# EAGLE design 足駆動回路 (EAGLE 9.6.2)
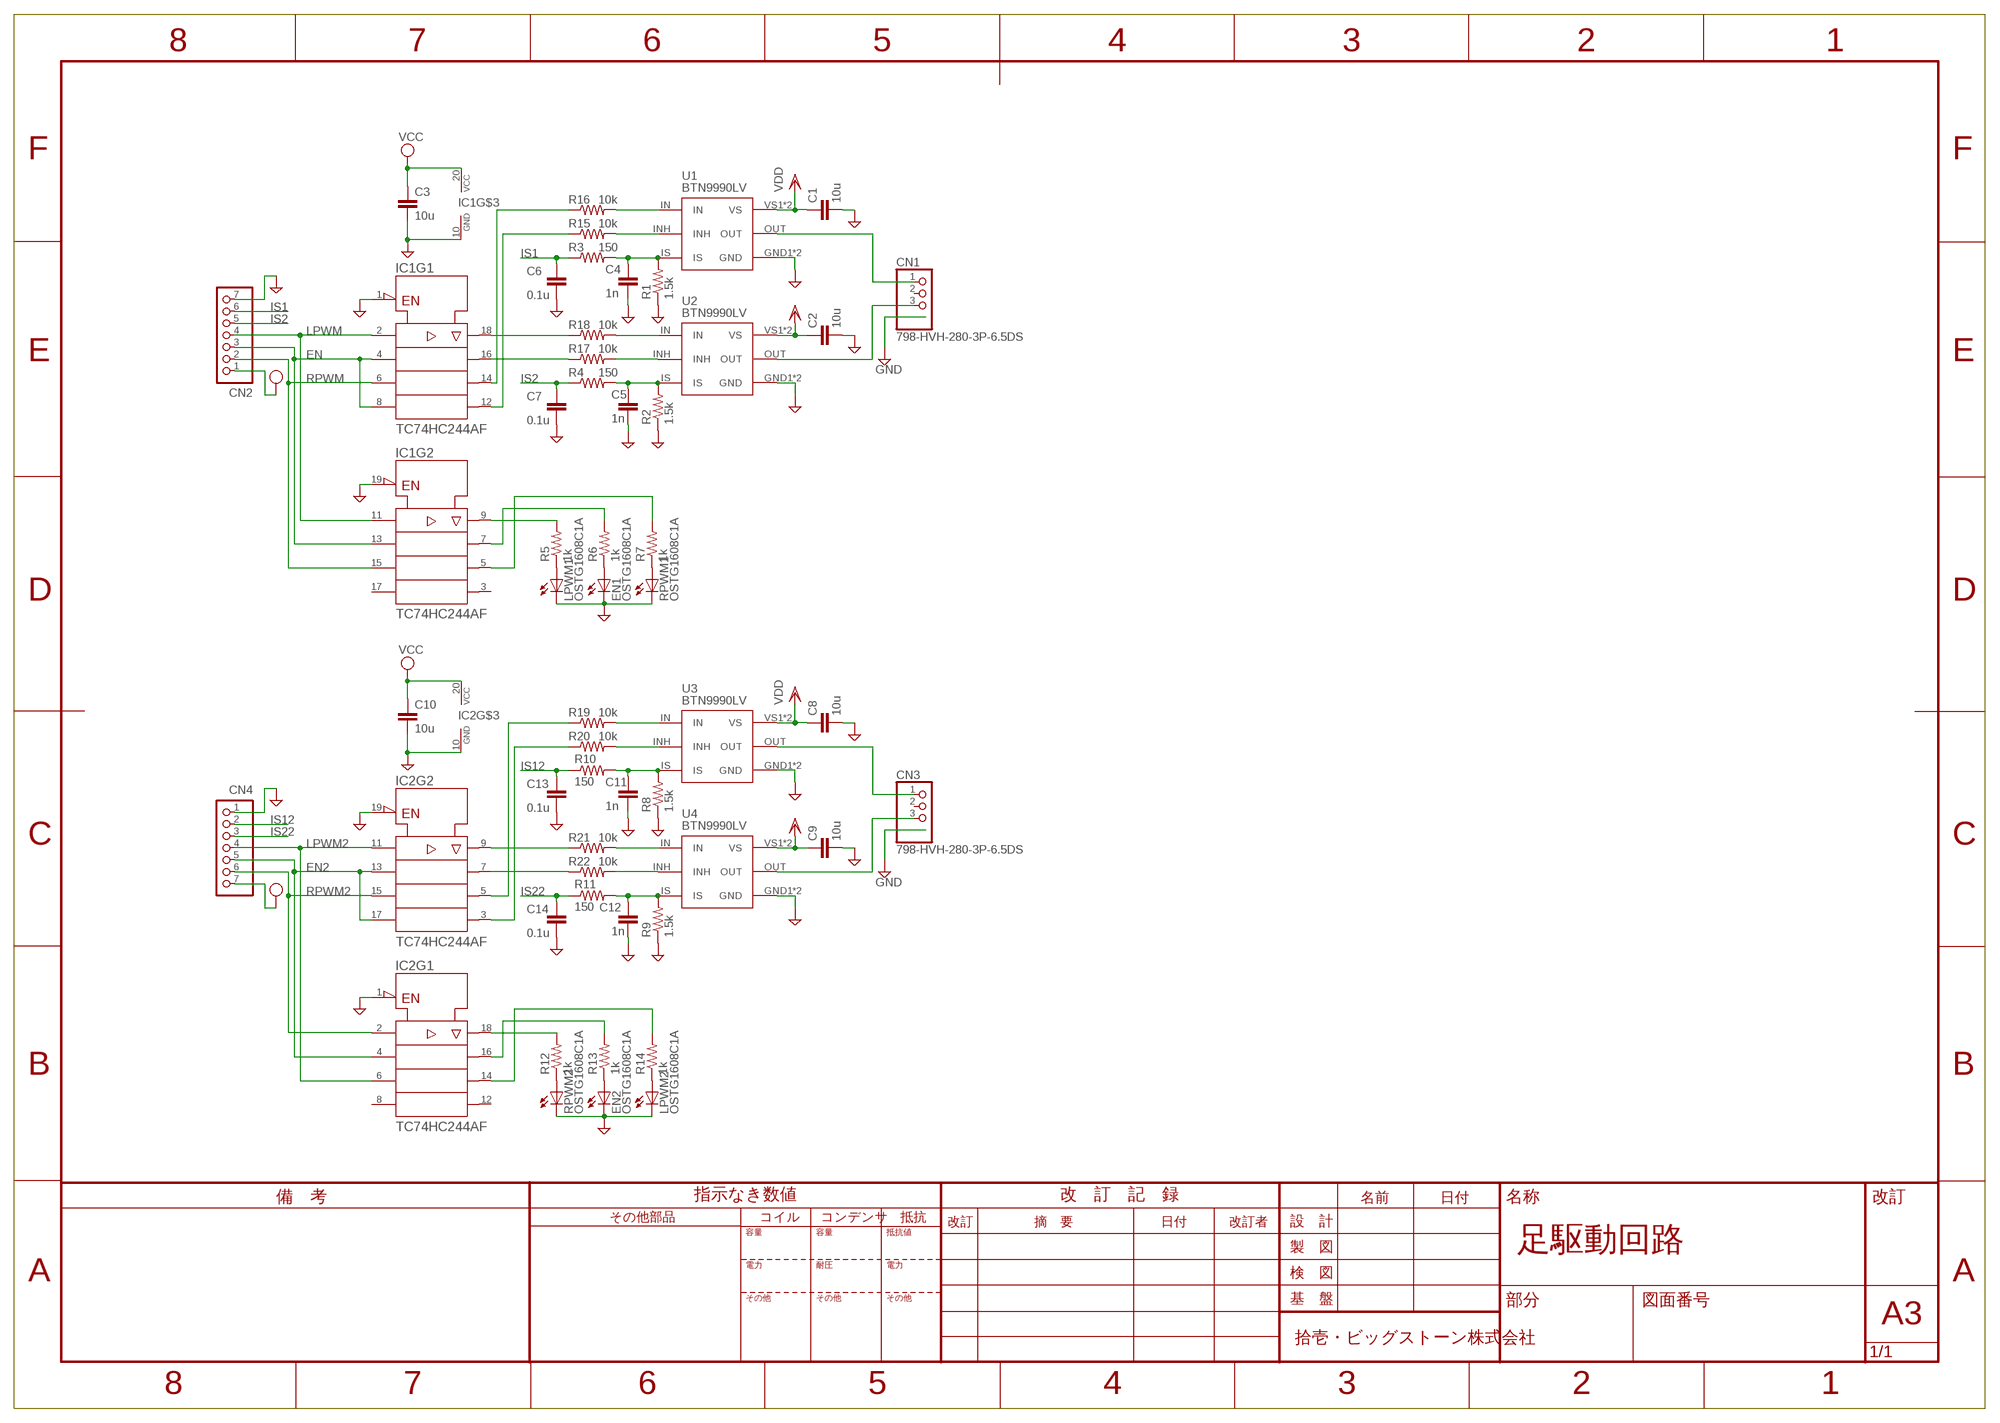
[diagram p0: schematic, sheet 1]

## Parts
C1  10u  GCM31CD71H106KE36K  [C3216]
C2  10u  GCM31CD71H106KE36K  [C3216]
C3  10u  GCM31CD71H106KE36K  [C3216]
C4  1n  GCM188R91H102KA37D  [C1608]
C5  1n  GCM188R91H102KA37D  [C1608]
C6  0.1u  GCM188L81H104KA57D  [C1608]
C7  0.1u  GCM188L81H104KA57D  [C1608]
C8  10u  GCM31CD71H106KE36K  [C3216]
C9  10u  GCM31CD71H106KE36K  [C3216]
C10  10u  GCM31CD71H106KE36K  [C3216]
C11  1n  GCM188R91H102KA37D  [C1608]
C12  1n  GCM188R91H102KA37D  [C1608]
C13  0.1u  GCM188L81H104KA57D  [C1608]
C14  0.1u  GCM188L81H104KA57D  [C1608]
CN1  798-HVH-280-3P-6.5DS  [798-HVH-280-3P-6.5DS]
CN2  B7B-XH-A  [B7B-XH-A]
CN3  798-HVH-280-3P-6.5DS  [798-HVH-280-3P-6.5DS]
CN4  B7B-XH-A  [B7B-XH-A]
EN1  OSTG1608C1A  [LEDC1608X39N_G]
EN2  OSTG1608C1A  [LEDC1608X39N_G]
IC1  TC74HC244AF  [SOP20]
IC2  TC74HC244AF  [SOP20]
LPWM1  OSTG1608C1A  [LEDC1608X39N_G]
LPWM2  OSTG1608C1A  [LEDC1608X39N_G]
R1  1.5k  R1608  [R0603]
R2  1.5k  R1608  [R0603]
R3  150  R1608  [R0603]
R4  150  R1608  [R0603]
R5  1k  R1608  [R0603]
R6  1k  R1608  [R0603]
R7  1k  R1608  [R0603]
R8  1.5k  R1608  [R0603]
R9  1.5k  R1608  [R0603]
R10  150  R1608  [R0603]
R11  150  R1608  [R0603]
R12  1k  R1608  [R0603]
R13  1k  R1608  [R0603]
R14  1k  R1608  [R0603]
R15  10k  RC0603J10K  [R1608]
R16  10k  RC0603J10K  [R1608]
R17  10k  RC0603J10K  [R1608]
R18  10k  RC0603J10K  [R1608]
R19  10k  RC0603J10K  [R1608]
R20  10k  RC0603J10K  [R1608]
R21  10k  RC0603J10K  [R1608]
R22  10k  RC0603J10K  [R1608]
RPWM1  OSTG1608C1A  [LEDC1608X39N_G]
RPWM2  OSTG1608C1A  [LEDC1608X39N_G]
U1  BTN9990LV  [BTN9990LV]
U2  BTN9990LV  [BTN9990LV]
U3  BTN9990LV  [BTN9990LV]
U4  BTN9990LV  [BTN9990LV]

## Nets
EN: CN2.3 IC1.4(A2) IC1.8(A4) IC1.13(A2)
EN2: CN4.5 IC2.4(A2) IC2.13(A2) IC2.17(A4)
GND: C1.2 C2.2 C3.2 C4.2 C5.2 C6.2 C7.2 C8.2 C9.2 C10.2 C11.2 C12.2 C13.2 C14.2 CN1.P$1 CN1.P$2 CN1.P$3 CN1.P$4 CN2.7 CN3.P$1 CN3.P$2 CN3.P$3 CN3.P$4 CN4.1 EN1.K(C) EN2.K(C) IC1.1(!G) IC1.10(GND) IC1.19(!G) IC2.1(!G) IC2.10(GND) IC2.19(!G) LPWM1.K(C) LPWM2.K(C) R1.1 R2.1 R8.1 R9.1 RPWM1.K(C) RPWM2.K(C) U1.GND1(GND) U1.GND2(GND) U2.GND1(GND) U2.GND2(GND) U3.GND1(GND) U3.GND2(GND) U4.GND1(GND) U4.GND2(GND)
IS1: C6.1 CN2.6 R3.1
IS1_A: C4.1 R1.2 R3.2 U1.IS
IS1_A1: C11.1 R8.2 R10.2 U3.IS
IS2: C7.1 CN2.5 R4.1
IS2_1: C5.1 R2.2 R4.2 U2.IS
IS2_2: C12.1 R9.2 R11.2 U4.IS
IS12: C13.1 CN4.2 R10.1
IS22: C14.1 CN4.3 R11.1
LPWM: CN2.4 IC1.2(A1) IC1.11(A1)
LPWM2: CN4.4 IC2.6(A3) IC2.11(A1)
N$1: IC1.18(Y1) R18.1
N$2: IC1.16(Y2) R17.1
N$3: IC1.14(Y3) R16.1
N$4: IC1.12(Y4) R15.1
N$5: LPWM1.A R5.1
N$6: EN1.A R6.1
N$7: R7.1 RPWM1.A
N$8: IC1.9(Y1) R5.2
N$9: IC1.7(Y2) R6.2
N$10: IC1.5(Y3) R7.2
N$11: IC2.9(Y1) R21.1
N$12: IC2.7(Y2) R22.1
N$13: IC2.5(Y3) R19.1
N$14: IC2.3(Y4) R20.1
N$15: R12.1 RPWM2.A
N$16: EN2.A R13.1
N$17: LPWM2.A R14.1
N$18: IC2.18(Y1) R12.2
N$19: IC2.16(Y2) R13.2
N$20: IC2.14(Y3) R14.2
N$21: R15.2 U1.INH
N$22: R16.2 U1.IN
N$23: R17.2 U2.INH
N$24: R18.2 U2.IN
N$25: R19.2 U3.IN
N$26: R20.2 U3.INH
N$27: R21.2 U4.IN
N$28: R22.2 U4.INH
OUT1 [power]: CN1.1 U1.OUT
OUT2 [power]: CN1.3 U2.OUT
OUT3 [power]: CN3.1 U3.OUT
OUT4 [power]: CN3.3 U4.OUT
RPWM: CN2.2 IC1.6(A3) IC1.15(A3)
RPWM2: CN4.6 IC2.2(A1) IC2.15(A3)
VCC: C3.1 C10.1 CN2.1 CN4.7 IC1.20(VCC) IC2.20(VCC)
VDD [power]: C1.1 C2.1 C8.1 C9.1 U1.VS1(VS) U1.VS2(VS) U2.VS1(VS) U2.VS2(VS) U3.VS1(VS) U3.VS2(VS) U4.VS1(VS) U4.VS2(VS)
Unconnected: CN1.2 CN3.2 IC1.3(Y4) IC1.17(A4) IC2.8(A4) IC2.12(Y4)

## Library data of the parts
C1-C3 C8-C10 = 村田製作所_チップセラミックコンデンサ:GCM?*: 一般用チップ積層セラミックコンデンサ GCMシリーズ; 01_CLASS: チップセラミックコンデンサ; 02_BENDER: DigiKey; 03_MAKER: ㈱村田製作所; 04_CHARA: 50V X7T ±10%; 05_COST: 245222; 06_QTY: 6000; 10_DIGIKEY_CODE: 490-GCM31CD71H106KE36KDKR-ND
C4 C5 C11 C12 = 村田製作所_チップセラミックコンデンサ:GCM?*: 一般用チップ積層セラミックコンデンサ GCMシリーズ; 01_CLASS: チップセラミックコンデンサ; 02_BENDER: DigiKey; 03_MAKER: ㈱村田製作所; 04_CHARA: 50V X8R ±10%; 05_COST: 13782; 06_QTY: 4000; 10_DIGIKEY_CODE: 490-14360-2-ND
C6 C7 C13 C14 = 村田製作所_チップセラミックコンデンサ:GCM?*: 一般用チップ積層セラミックコンデンサ GCMシリーズ; 01_CLASS: チップセラミックコンデンサ; 02_BENDER: DigiKey; 03_MAKER: ㈱村田製作所; 04_CHARA: 50V X8L ±10%; 05_COST: 14655; 06_QTY: 4000; 10_DIGIKEY_CODE: 490-6049-6-ND
CN1 CN3 = HVH-280:798-HVH-280-3P-6.5DS
CN2 CN4 = jst-xh:B7B-XH-A: Wire-to-Board 2.5mm pitch top mount connector Source: http://www.jst-mfg.com/product/pdf/jpn/XH.pdf http://www.jst-mfg.com/product/detail.php?series=277
EN1 EN2 LPWM1 LPWM2 RPWM1 RPWM2 = LED:OSTG1608C1A: 緑色チップＬＥＤ ［１６０８］ ＯＳＴＧ１６０８Ｃ１Ａ （２０個入） [OSTG1608C1A] 通販コード I-06417 発売日 2013/03/26 ・標準電流：5mA ◆絶対最大定格(Ta=25℃) ・VR：5V ・PD：100mW ◆電気光学特性(IF=5mA、Ta=25℃、Typ.) ・VF：2.9V ・IV：103mcd D：525nm ・2θ1/2：120° ■カラーバリエーション 白色I-03986 </catalog/g/gI-03986/> 赤色I-03978 </catalog/g/gI-03978/> 緑色I-06417 </catalog/g/gI-06417/> 青色I-03982 </catalog/g/gI-03982/> 黄色I-03984 </catalog/g/gI-03984/> 橙色I-06416 </catalog/g/gI-06416/> 黄緑色I-03980 </catalog/g/gI-03980/> ウォームホワイト色I-09640 </catalog/g/gI-09640> [I-06417] 緑色チップＬＥＤ ［１６０８］ ＯＳＴＧ１６０８Ｃ１Ａ （２０個入） 1パック ￥250（税込）
IC1 IC2 = 東芝_74LSシリーズ:TC74HC244
R1-R14 = RCL:R: RESISTOR, American symbol; SPICEPREFIX: R
R15-R22 = FLE_抵抗器:RC0603J: チップ抵抗 RCシリーズ 1608サイズ; 01_CLASS: チップ抵抗; 02_BENDER: 秋月電子通商; 03_MAKER: FAITHFUL LINK INDUSTRIAL CORP.; 04_CHARA: 1/10W ±5%; 05_COST: 980; 06_QTY: 5000; 10_AKIZUKI_CODE: R-15029
U1-U4 = IT_MotorControlIC:BTN9990LV

## Net classes
1 power: clearance 0.254 mm

## Board
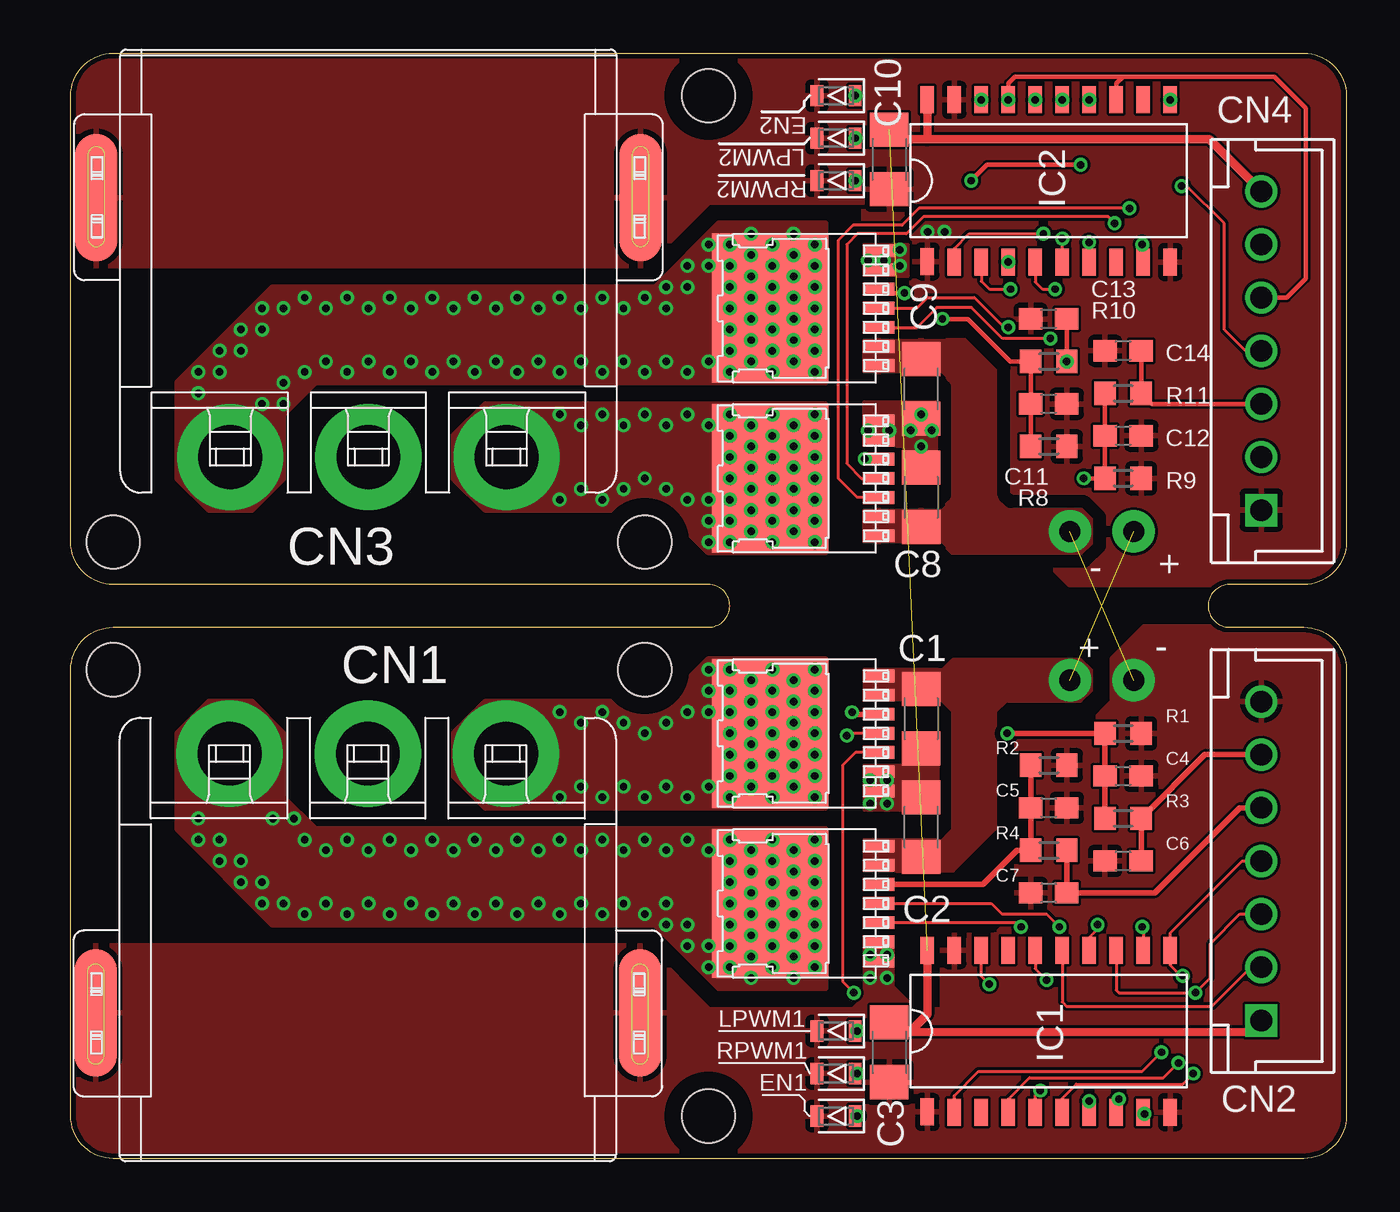
[diagram p1: board, top side]
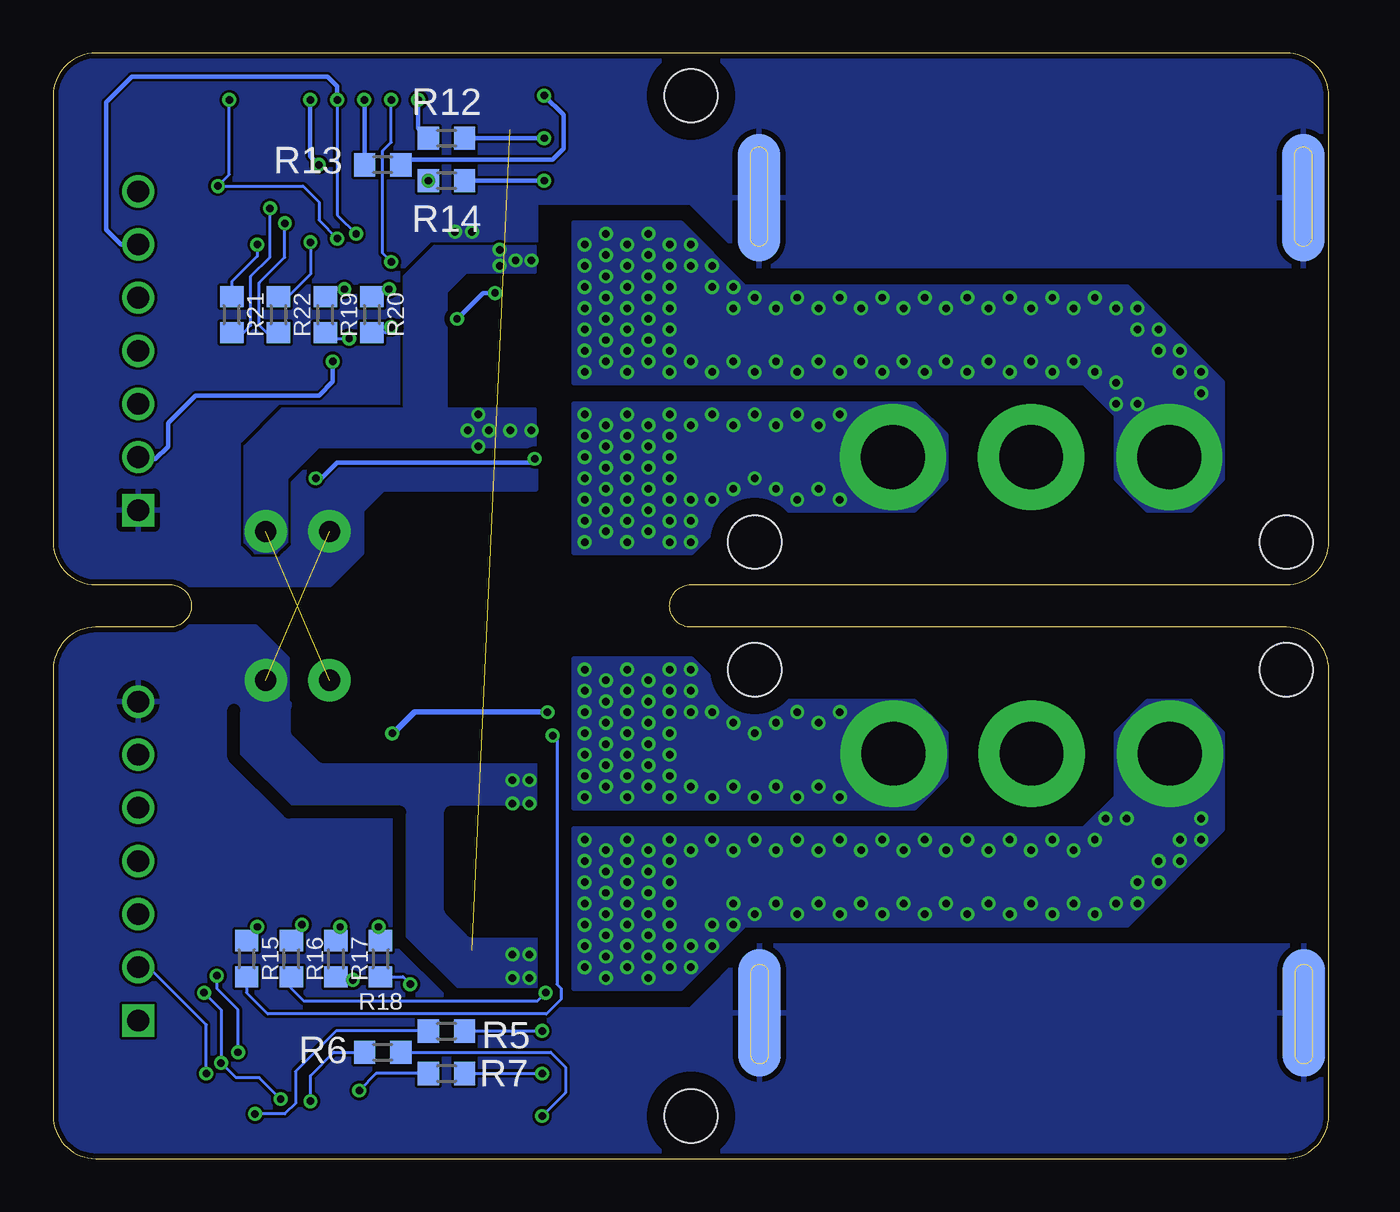
[diagram p2: board, bottom side, seen from below]

Size 60 x 52 mm. Coordinates in mm from the lower left corner, seen from the top.
Outline: 0,2 0,23 arc-90 2,25 30,25 arc90 31,26 arc90 30,27 2,27 arc-90 0,29 0,50 arc-90 2,52 58,52 arc-90 60,50 60,29 arc-90 58,27 54.5,27 arc90 53.5,26 arc90 54.5,25 58,25 arc-90 60,23 60,2 arc-90 58,0 2,0 arc-90 0,2
Copper layers (1*16): Top 0.035mm / dielectric 1.6mm / Bottom 0.035mm
Design rules "JLPCB_2layer": minimum track width 5mil, minimum drill 0.2mm, track to track 5mil, track to pad 5mil, pad to pad 5mil, via to via 5mil, smd to smd 0mil, copper to edge 0.25mm, drill to drill 0.25mm, minimum pad ring 6mil, minimum via ring 6mil, stop-mask expansion 0mil, vias tented up to drill 0.6mm, thermal gap 10mil
Holes 2.5 mm at 2,23 27,23 30,2 27,29 2,29 30,50
tRestrict: area 25,21 to 29,25; area 0,21 to 4,25; area 28,0 to 32,4; area 25,27 to 29,31; area 0,27 to 4,31; area 28,48 to 32,52; 18 lines
bRestrict: area 25,21 to 29,25; area 0,21 to 4,25; area 28,0 to 32,4; area 25,27 to 29,31; area 0,27 to 4,31; area 28,48 to 32,52; 15 lines

### Footprints (pad centres in the part's own frame; a part is rotated, then mirrored left to right if it is on the bottom)
C3216 = smd 1.6 x 1.8: 1 -1.4,0; 2 1.4,0
C1608 = smd 1.1 x 1: 1 -0.85,0; 2 0.85,0
798-HVH-280-3P-6.5DS = drill 3 pad 5: 1 -6.5,0; 2 0,0; 3 6.5,0 | smd 2 x 6 bottom: P$1 -12.8,12.2; P$2 12.8,12.2 | smd 2 x 6: P$3 -12.8,12.2; P$4 12.8,12.2
B7B-XH-A = drill 1.016 square: 1 -7.5,0 | drill 1.016: 2 -5,0; 3 -2.5,0; 4 0,0; 5 2.5,0; 6 5,0; 7 7.5,0
LEDC1608X39N_G = smd 0.6 x 1: A -0.9,0; K 0.9,0
SOP20 = smd 0.635 x 1.27: 1 -5.715,-3.8; 2 -4.445,-3.82; 3 -3.175,-3.82; 4 -1.905,-3.82; 5 -0.635,-3.82; 6 0.635,-3.82; 7 1.905,-3.82; 8 3.175,-3.82; 9 4.445,-3.82; 10 5.715,-3.82; 11 5.715,3.8; 12 4.445,3.8; 13 3.175,3.8; 14 1.905,3.8; 15 0.635,3.8; 16 -0.635,3.8; 17 -1.905,3.8; 18 -3.175,3.8; 19 -4.445,3.8; 20 -5.715,3.8
R0603 = smd 1 x 1.1: 1 -0.85,0; 2 0.85,0
R1608 = smd 1 x 1.1: 1 -0.85,0; 2 0.85,0
BTN9990LV = smd 0.6 x 1.5: GND1 -2.7,-3.5; GND2 -1.8,-3.5; IN -0.9,-3.5; INH 0,-3.5; IS 0.9,-3.5; VS1 1.8,-3.5; VS2 2.7,-3.5 | smd 7 x 5.5: OUT 0,1.6

### Placement (x,y rotation side)
C1  40,20.7 270 top
C2  40,15.6 90 top
C3  38.5,5 270 top
C4  49.5,18 0 top
C5  46,16.5 0 top
C6  49.5,14 180 top
C7  46,12.5 180 top
C8  40,31.1 270 top
C9  40,36.2 90 top
C10  38.5,47 270 top
C11  46,35.5 0 top
C12  49.5,34 0 top
C13  46,39.5 180 top
C14  49.5,38 180 top
CN1  13.97,19.05 180 top
CN2  56,14 90 top
CN3  14,33 0 top
CN4  56,38 90 top
EN1  36,2 180 top
EN2  36,50 180 top
IC1  46,6 0 top
IC2  46,46 0 top
LPWM1  36,6 180 top
LPWM2  36,46 180 top
R1  49.5,20 180 top
R2  46,18.5 180 top
R3  49.5,16 180 top
R4  46,14.5 180 top
R5  41.5,6 180 bottom
R6  44.5,5 180 bottom
R7  41.5,4 180 bottom
R8  46,33.5 180 top
R9  49.5,32 180 top
R10  46,37.5 180 top
R11  49.5,36 180 top
R12  41.5,48 180 bottom
R13  44.5,46.75 180 bottom
R14  41.5,46 180 bottom
R15  50.9,9.4 270 bottom
R16  48.8,9.4 270 bottom
R17  46.7,9.4 90 bottom
R18  44.6,9.4 90 bottom
R19  47.2,39.7 270 bottom
R20  45,39.7 270 bottom
R21  51.6,39.7 270 bottom
R22  49.4,39.7 270 bottom
RPWM1  36,4 180 top
RPWM2  36,48 180 top
U1  34.5,20 90 top
U2  34.5,12 90 top
U3  34.5,40 90 top
U4  34.5,32 90 top

### Tracks (layer width: path | path; a pad name or v marks a point on that pad's centre or on a via)
EN  (via drill 0.35)
  Top 0.15: IC1.4 44.09,2.79 45.1,3.8 51.4,3.8 v52.1,4.5 | IC1.8 49.17,2.67 v49.3,2.8 | IC1.13 49.17,7.92 49.3,7.8 v52.9,7.8 53.6,8.5 53.6,10.1 55,11.5 CN2.3
  Bottom 0.15: v49.3,2.8 50.3,3.8 51.4,3.8 v52.1,4.5 52.1,7 v52.9,7.8
EN2  (via drill 0.35)
  Top 0.2: CN4.5 57.2,40.5 58.1,41.4 58.1,49.4 56.6,50.9 49.5,50.9 | 49.5,50.9 49.17,50.58 IC2.13 | IC2.17 44.09,50.59 44.4,50.9 49.5,50.9
  Bottom 0.15: IC2.4 44.5,42.59 44.5,47.4 44.09,47.8 IC2.17
  other vias: 44.09,42.18 44.09,49.8
GND  (via drill 0.35, 1 pad 2)  (1 unrouted)
  other vias: 37.6,17.8 38.4,17.8 37.6,9.6 38.4,9.6 37.6,8.5 38.4,8.5 37.6,16.7 38.4,16.7 50,22.5 47,29.5 40.3,43.6 41.1,43.6
  pour Top (rank 2): 0,0 0,10 27,10 30,7 41,7 41,10.5 43.5,10.5 44.5,11.5 44.5,19.5 45.5,20.5 48,20.5 49,21.5 49,23.5 50.5,25 60,25 60,0
  pour Bottom (rank 2): 0,10 0,0 60,0 60,25 50.5,25 49,23.5 49,21.5 48,20.5 37.3,20.5 37.3,7 30,7 27,10
  pour Top (no thermals): 37.3,10.3 37.3,7.6 36.7,7 39.8,7 38.7,8.1 38.7,10.3
  pour Top (no thermals): 37.3,16.4 40.8,16.4 40.8,19.6 39.2,19.6 39.2,18.5 37.3,18.5
  pour Top (rank 2): 0,52 0,42 27,42 30,45 37.3,45 37.3,28.5 45.5,28.5 47,27 60,27 60,52
  pour Bottom (rank 2): 0,42 0,52 60,52 60,27 47,27 45.5,28.5 45.5,30.5 44.5,31.5 37.3,31.5 37.3,45 30,45 27,42
  pour Top (no thermals): 37.3,29 37.3,30.5 41,30.5 41.5,31 41.5,36.5 41,37 37.3,37 37.3,38.5 42,38.5 43.5,37 43.5,31 44,30.5 47.5,30.5 48,30 48,29 47.5,28.5 41.5,28.5 41,29
IS1
  Top 0.254: C6.1 R3.1 53.35,19 CN2.6
IS1_A  (via drill 0.35)
  Top 0.254: R3.2 C4.1 R1.2 v44.05,20 | U1.IS 36.85,20.9 v36.75,21
  Bottom 0.254: v36.75,21 43,21 44,20 v44.05,20
IS1_A1  (via drill 0.35)
  Top 0.2: R8.2 C11.1 R10.2 44.2,37.5 42.2,39.5 v41,39.5 | v39.21,40.71 38.19,40.71 U3.IS
  Bottom 0.2: v41,39.5 39.79,40.71 v39.21,40.71
IS2
  Top 0.254: R4.1 C7.1 51,12.5 55,16.5 CN2.5
IS2_1
  Top 0.254: R2.2 C5.1 R4.2 44.5,14.5 42.9,12.9 U2.IS
IS2_2  (via drill 0.35)
  Top 0.2: R11.2 C12.1 R9.2 v47.65,32 | U4.IS 37.37,32.9 v37.35,32.92
  Bottom 0.2: v37.35,32.92 37.52,32.75 46.65,32.75 47.4,32 v47.65,32
IS12  (via drill 0.35)
  Top 0.2: R10.1 C13.1
  Bottom 0.2: R10.1 46.85,36.55 47.5,35.9 53.3,35.9 54.6,34.6 54.6,33.5 55.2,32.9 55.9,32.9 CN4.2
  other vias: 46.85,37.5
IS22
  Top 0.2: C14.1 R11.1 50.85,35.5 CN4.3
LPWM  (via drill 0.35)
  Top 0.15: IC1.2 41.55,2.96 42.7,4.1 50.4,4.1 v51.3,5 | v52.3,8.6 52.22,8.6 51.72,9.1 IC1.11 51.72,10.62 55.1,14 CN2.4
  Bottom 0.15: v51.3,5 51.3,7 52.3,8 v52.3,8.6 52.2,8.6
LPWM2  (via drill 0.35)
  Top 0.15: CN4.4 55.25,38 54.25,39 54.25,44 52.5,45.75 v52.25,45.75
  Top 0.152: IC2.6 v46.63,43.28
  Bottom 0.15: IC2.11 51.72,46.28 v52.25,45.75 48.25,45.75 47.5,45 47.5,44.15 v46.63,43.28
  other vias: 51.72,49.8
N$1  (via drill 0.35)
  Top 0.152: v43.2,8.2 42.83,8.57 IC1.18
  Bottom 0.152: R18.1 43.55,8.55 v43.2,8.2
N$2  (via drill 0.35)
  Top 0.152: IC1.16 45.37,8.94 v45.9,8.4
  Bottom 0.152: v45.9,8.4 46.05,8.55 R17.1
N$3  (via drill 0.35)
  Top 0.152: v48.3,11 48.3,10.79 47.91,10.4 IC1.14
  Bottom 0.152: R16.1 48.8,10.5 v48.3,11
N$4  (via drill 0.35)
  Top 0.15: IC1.12 50.5,9.74
  Top 0.152: v50.4,10.9 50.45,10.86 IC1.12
  Bottom 0.152: v50.4,10.9 50.9,10.4 R15.1
N$5  (via drill 0.35)
  Top 0.15: LPWM1.A v37,6
  Bottom 0.152: R5.1 v37,6
N$6  (via drill 0.35)
  Top 0.15: EN1.A v37,2
  Bottom 0.152: 37.1,2.1 v37,2 35.9,3.1 35.9,4.3 36.6,5 R6.1
N$7  (via drill 0.35)
  Top 0.15: RPWM1.A v37,4
  Bottom 0.152: R7.1 v37,4
N$8  (via drill 0.35)
  Top 0.15: v50.5,2.1 50.5,2.12 IC1.9
  Bottom 0.15: v50.5,2.1 49.1,2.1 48.6,2.6 48.6,4.1 47.8,4.9
  Bottom 0.152: R5.2 46.7,6 47.8,4.9
N$9  (via drill 0.35)
  Top 0.15: IC1.7 47.91,1.71
  Top 0.152: IC1.7 v47.91,2.69 v47.9,2.7
  Bottom 0.152: v47.9,2.7 47.9,3.9 46.8,5 R6.2
N$10  (via drill 0.35)
  Top 0.15: IC1.5 45.37,2.96 v45.6,3.2
  Bottom 0.152: R7.2 44.8,4 v45.6,3.2
N$11  (via drill 0.35)
  Top 0.152: IC2.9 50.45,42.95 v50.4,43
  Bottom 0.152: v50.4,43 50.4,42.45 51.6,41.25 R21.1
N$12  (via drill 0.35)
  Top 0.152: IC2.7 v47.91,43.09 v47.9,43.1
  Bottom 0.152: v47.9,43.1 47.9,41.6 48.95,40.55 R22.1
N$13  (via drill 0.35)
  Top 0.152: IC2.5 45.37,41.23 45.7,40.9 v46.3,40.9
  Bottom 0.152: v46.3,40.9 46.85,40.9 R19.1
N$14  (via drill 0.35)
  Top 0.152: IC2.3 42.83,41.27 43.2,40.9 v44.2,40.9
  Bottom 0.152: v44.2,40.9 44.65,40.9 R20.1
N$15  (via drill 0.35)
  Bottom 0.2: R12.1 RPWM2.A
  other vias: 36.9,48
N$16  (via drill 0.35)
  Bottom 0.2: EN2.A 36,49.1 36,47.5 36.5,47 43.4,47 R13.1
  other vias: 36.9,50
N$17  (via drill 0.35)
  Bottom 0.2: R14.1 LPWM2.A
  other vias: 36.9,46
N$18  (via drill 0.35)
  Bottom 0.2: R12.2 42.83,48.48 IC2.18
  other vias: 42.83,49.8
N$19  (via drill 0.35)
  Bottom 0.2: R13.2 45.35,49.78 IC2.16
  other vias: 45.37,49.8
N$20  (via drill 0.35)
  Top 0.2: R14.2 43.1,46.75 v47.5,46.75
  Bottom 0.2: v47.5,46.75 47.91,47.16 IC2.14
  other vias: 42.35,46 47.91,49.8
N$21  (via drill 0.35)
  Top 0.152: U1.INH 36.6,20 v36.5,19.9
  Bottom 0.152: v36.5,19.9 36.3,19.7 36.3,8.2 36.1,8 36.1,7.5 36.8,6.8 49.9,6.8 50.9,7.8 R15.2
N$22  (via drill 0.35)
  Top 0.152: U1.IN 36.9,19.1 36.3,18.5 36.3,8.33 v36.83,7.8
  Bottom 0.152: v36.83,7.8 37.23,7.4 48.2,7.4 48.8,8 R16.2
N$23  (via drill 0.35)
  Top 0.152: U2.INH 43.3,12 43.8,11.5 45.9,11.5 v46.5,10.9
  Bottom 0.152: v46.5,10.9 46.7,10.7 R17.2
N$24  (via drill 0.35)
  Top 0.152: U2.IN 44.5,11.1 v44.7,10.9
  Bottom 0.152: v44.7,10.9 44.6,10.8 R18.2
N$25  (via drill 0.35)
  Top 0.152: v46.08,38.58 43.82,38.58 42.37,40.03 40.73,40.03 39.8,39.1 U3.IN
  Bottom 0.152: R19.2 46.93,38.58 v46.08,38.58
N$26  (via drill 0.35)
  Top 0.152: U3.INH 39.8,40 40.3,40.5 42.5,40.5 43.89,39.11 v44.1,39.11
  Bottom 0.152: v44.1,39.11 44.36,38.85 R20.2
N$27  (via drill 0.35)
  Top 0.152: v49.8,44.7 39.9,44.7 39.1,43.9 36.8,43.9 36.1,43.2 36.1,32 37,31.1 U4.IN
  Bottom 0.152: R21.2 51.05,38.85 50.7,39.2 50.7,41.5 49.8,42.4 v49.8,44.7
N$28  (via drill 0.35)
  Top 0.152: v49.1,44 48.8,44.3 40.1,44.3 39.3,43.5 37,43.5 36.5,43 36.5,32.7 37.2,32 U4.INH
  Bottom 0.152: R22.2 49.95,38.85 50.3,39.2 50.3,41.2 49.1,42.4 v49.1,44
OUT1  (via drill 0.35)
  other vias: 31,23 31,22 32,22.5 32,21.5 31,21 32,19.5 31,19 32,20.5 31,20 33,17 31,18 32,17.5 32,18.5 31,17 33,18 33,19 33,20 33,21 33,22 33,23 34,22.5 34,21.5 34,20.5 34,19.5 34,18.5 34,17.5 35,17 35,18 35,19 35,20 35,21 35,22 35,23 30,17.5 29,17 28,17.5 27,17 26,17.5 25,17 24,17.5 23,17 23,21 24,20.5 25,21 26,20.5 27,20 28,20.5 29,21 30,22 30,21 30,23
  pour Top (no thermals): 18,20 18,18 19.5,16.5 35.5,16.5 35.5,23.5 30,23.5 28,21.5 19.5,21.5
  pour Bottom (no thermals): 18,20 18,18 19.5,16.5 35.5,16.5 35.5,23.5 30,23.5 28,21.5 19.5,21.5
OUT2  (via drill 0.35)
  other vias: 35,15 35,14 35,13 35,12 35,11 35,10 35,9 34,8.5 34,9.5 34,10.5 34,11.5 34,12.5 34,13.5 34,14.5 33,15 33,14 33,13 33,12 33,11 33,10 33,9 32,8.5 32,9.5 32,10.5 32,11.5 32,12.5 32,13.5 32,14.5 31,15 31,14 31,13 31,12 31,11 31,10 31,9 30,14.5 29,15 28,14.5 27,15 26,14.5 25,15 24,14.5 23,15 22,14.5 21,15 20,14.5 19,15 18,14.5 17,15 16,14.5 15,15 14,14.5 13,15 12,14.5 11,15 10.5,16 9.5,16 30,9 29,10 30,10 28,11 29,11 27,11.5 28,12 26,12 25,11.5 24,12 23,11.5 22,12 21,11.5 20,12 19,11.5 18,12 17,11.5 16,12 15,11.5 14,12 13,11.5 12,12 11,11.5 10,12 9,12 9,13 8,13 8,14 7,14 7,15 6,15 6,16
  pour Top (no thermals): 35.5,15.5 11.5,15.5 10,17 10,20 8.5,21.5 6.5,21.5 5,20 5,15.5 9.5,11 27.5,11 30.5,8 35.5,8
  pour Bottom (no thermals): 35.5,15.5 11.5,15.5 10,17 10,20 8.5,21.5 6.5,21.5 5,20 5,15.5 9.5,11 27.5,11 30.5,8 35.5,8
OUT3  (via drill 0.35)
  other vias: 35,37 35,38 35,39 35,40 35,41 35,42 35,43 34,43.5 34,42.5 34,41.5 34,40.5 34,39.5 34,38.5 34,37.5 33,37 33,38 33,39 33,40 33,41 33,42 33,43 32,43.5 32,42.5 32,41.5 32,40.5 32,39.5 32,38.5 32,37.5 31,37 31,38 31,39 31,40 31,41 31,42 31,43 30,37.5 29,37 28,37.5 27,37 26,37.5 25,37 24,37.5 23,37 22,37.5 21,37 20,37.5 19,37 18,37.5 17,37 16,37.5 15,37 14,37.5 13,37 12,37.5 11,37 10,36.5 10,35.5 30,43 29,42 30,42 28,41 29,41 27,40.5 26,40 25,40.5 24,40 23,40.5 28,40 22,40 21,40.5 20,40 19,40.5 18,40 17,40.5 16,40 15,40.5 14,40 13,40.5 12,40 11,40.5 10,40 9,40 9,39 8,39 8,38 7,38 7,37 6,37 6,36 9,35.5
  pour Bottom (no thermals): 35.5,36.5 11.5,36.5 10,35 10,32 8.5,30.5 6.5,30.5 5,32 5,36.5 9.5,41 27.5,41 30.5,44 35.5,44
  pour Top (no thermals): 35.5,36.5 11.5,36.5 10,35 10,32 8.5,30.5 6.5,30.5 5,32 5,36.5 9.5,41 27.5,41 30.5,44 35.5,44
OUT4  (via drill 0.35)
  other vias: 31,29 31,30 31,31 31,32 31,33 31,34 31,35 32,34.5 32,33.5 32,32.5 32,31.5 32,30.5 32,29.5 33,29 33,30 33,31 33,32 33,33 33,34 33,35 34,34.5 34,33.5 34,32.5 34,31.5 34,30.5 34,29.5 35,29 35,30 35,31 35,32 35,33 35,34 35,35 30,34.5 29,35 28,34.5 27,35 26,34.5 25,35 24,34.5 23,35 30,29 30,30 30,31 29,31 28,31.5 27,32 26,31.5 25,31 24,31.5 23,31
  pour Bottom (no thermals): 18,32 18,34 19.5,35.5 35.5,35.5 35.5,28.5 30,28.5 28,30.5 19.5,30.5
  pour Top (no thermals): 18,32 18,34 19.5,35.5 35.5,35.5 35.5,28.5 30,28.5 28,30.5 19.5,30.5
RPWM  (via drill 0.35)
  Top 0.15: IC1.6 46.63,2.83 47.3,3.5 52.3,3.5 v52.8,4 | IC1.15 46.63,7.37 46.83,7.17 53.67,7.17 55.5,9 CN2.2
  Bottom 0.15: CN2.2 55.5,9 52.8,6.3 v52.8,4
RPWM2  (via drill 0.35)
  Top 0.15: IC2.2 41.55,42.8 42.25,43.5 v45.75,43.5
  Bottom 0.15: v45.75,43.5 46.63,44.38 IC2.15
  Bottom 0.2: CN4.6 56.8,43 57.5,43.7 57.5,49.7 56.3,50.9 47.1,50.9 46.63,50.44 IC2.15
  other vias: 46.63,49.8
VCC  (1 unrouted)
  Top 0.406: IC1.20 40.28,6.79 39.45,5.95 C3.1 38.4,6.4 38.43,5.97 55.44,5.94 CN2.1 | IC2.20 40.28,47.95 38.95,47.95 C10.1 38.59,48.31 38.55,47.95 53.55,47.95 CN4.7
VDD  (via drill 0.35, 1 pad 2)  (1 unrouted)
  other vias: 47,22.5 50,29.5 40,33.5 40.5,34.25 39.5,34.25 38.5,34.25 37.5,34.25 40,35 37.5,42.25 38.25,42.25 39,42.75 39,42
  pour Top (no thermals): 37.3,15 37.3,13.5 40.8,13.5 40.8,15
  pour Top (no thermals): 37.3,23 37.3,21.6 40.8,21.6 40.8,23
  pour Top (no thermals): 40.8,14.8 41.5,15.5 41.5,21 40.9,21.6 39.3,21.6 39.3,23 41,23 41.5,23.5 47.5,23.5 48,23 48,22 47.5,21.5 44,21.5 43.5,21 43.5,15.5 41.5,13.5 40.8,13.5
  pour Bottom (no thermals): 37.3,33.5 37.3,35.25 41.5,35.25 41.5,40.75 40.55,41.7 37.3,41.7 37.3,42.9 42.1,42.9 43.5,41.5 43.5,35.25 49.25,35.25 51,33.5 51,29 50.5,28.5 49.5,28.5 49,29 49,32 47.5,33.5
  pour Top (no thermals): 37.3,35.6 40.8,35.6 40.8,32.4 39.2,32.4 39.2,33.5 37.3,33.5
  pour Top (no thermals): 37.3,43 37.3,41.5 39.4,41.5 39.4,43

### Text on the board
tPlace: - | + | + | -